# EAGLE design SlippiBoardRev2 (EAGLE 7.5.0)

## Sheet 1 of 3: TM4C129ENCPDT GPIO
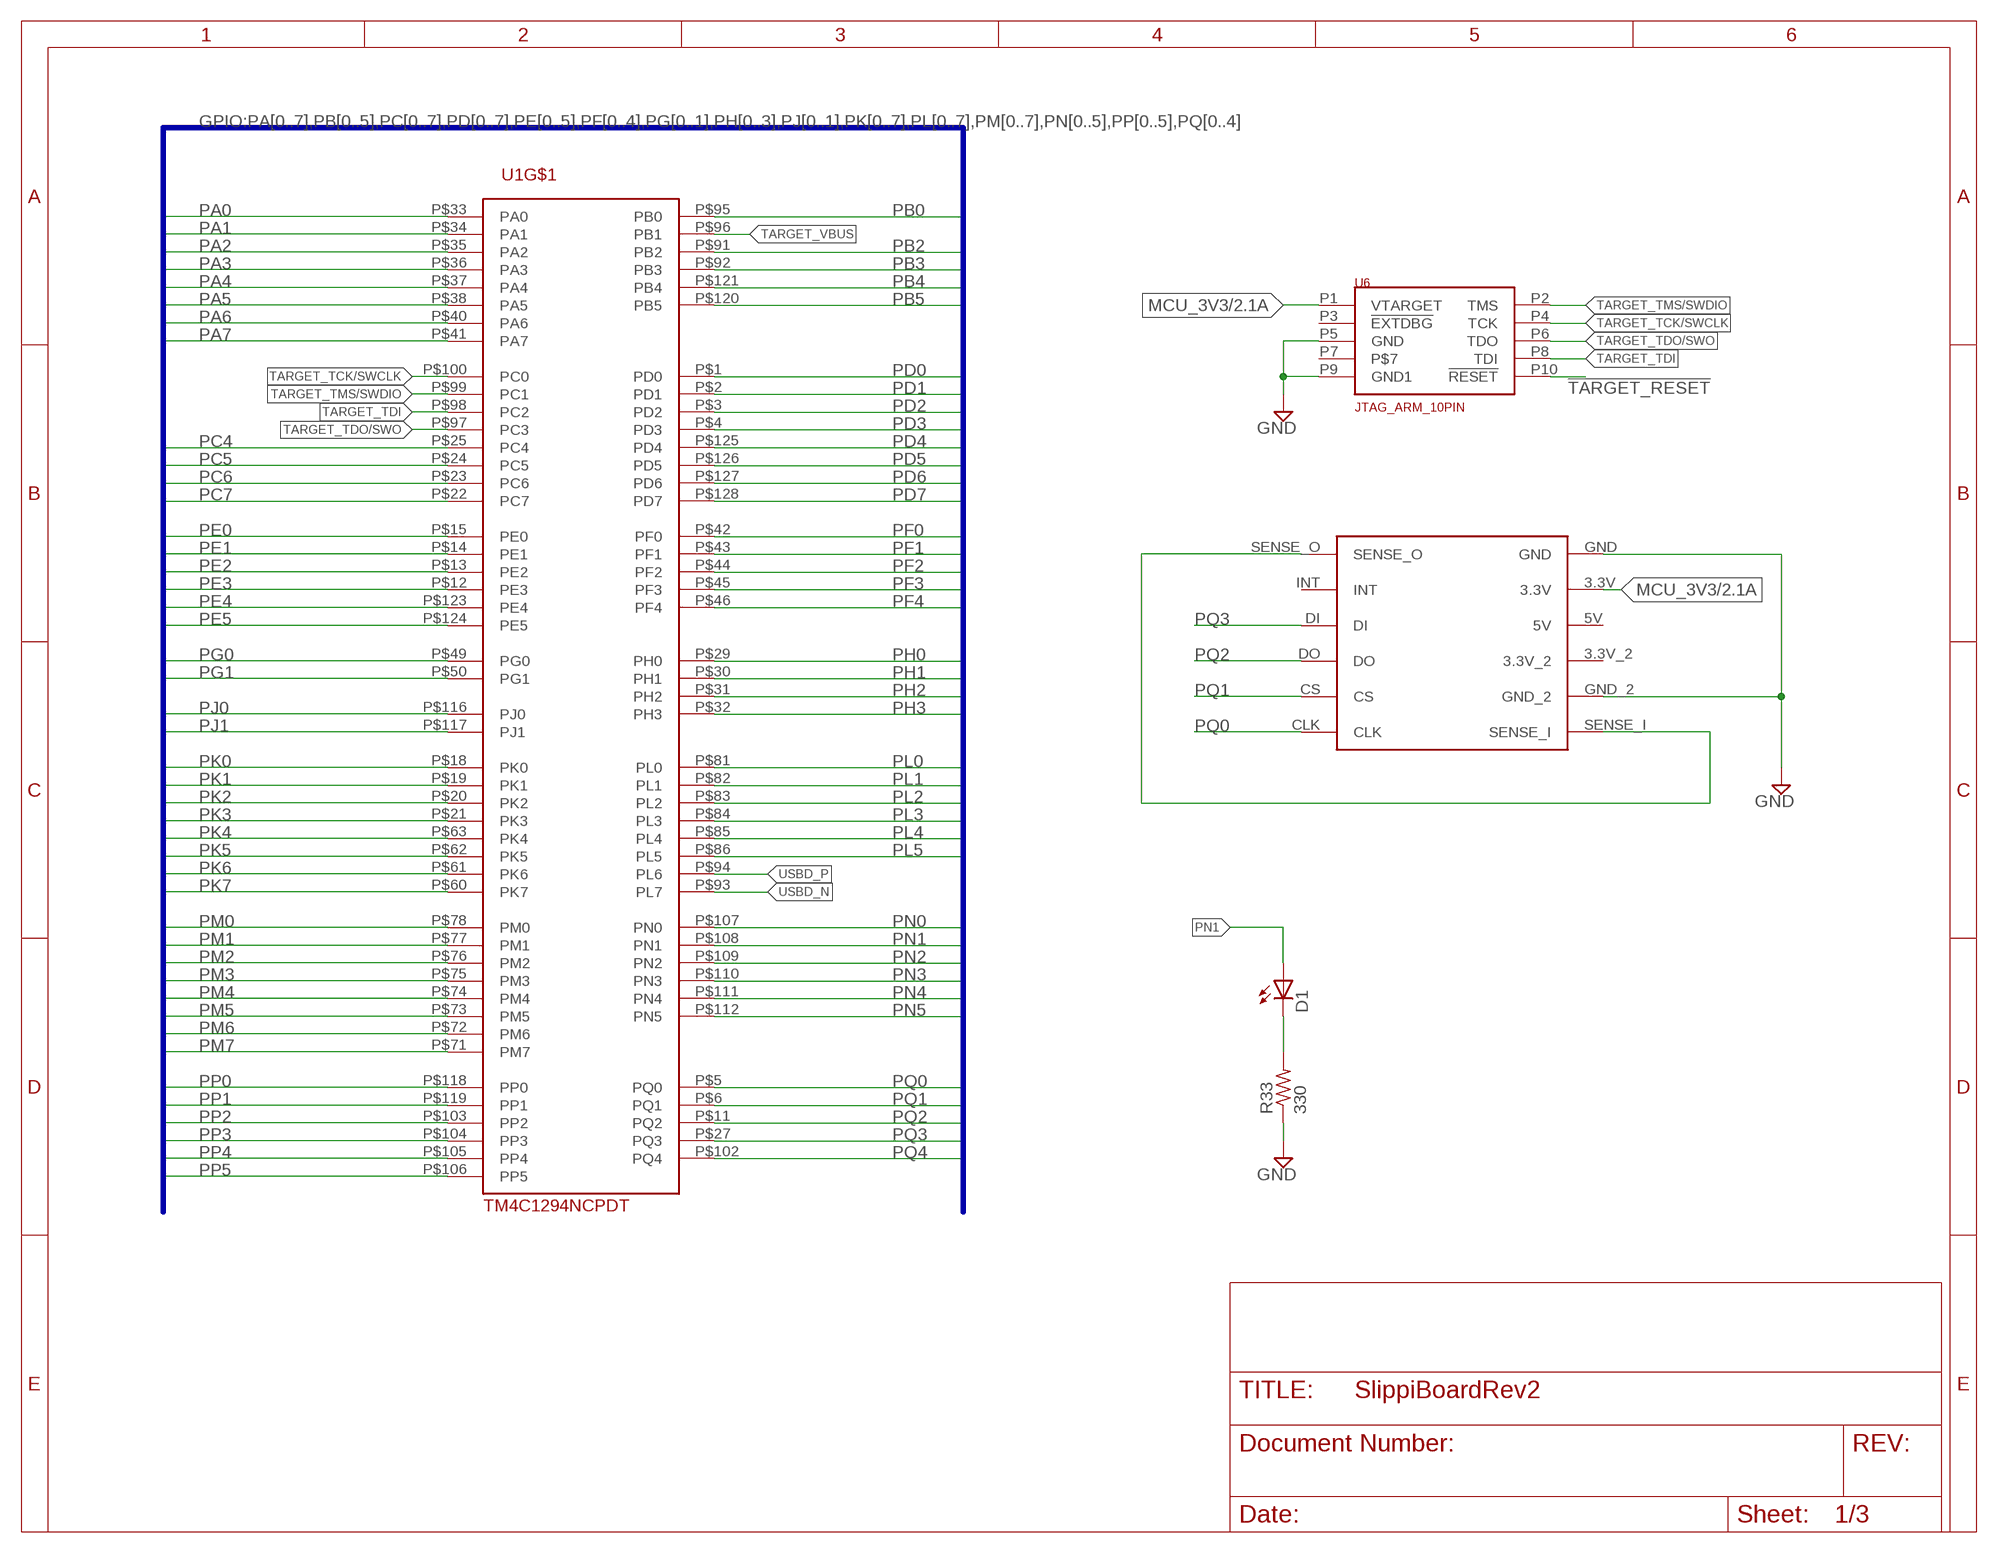
[diagram p0: schematic, sheet 1]

### Parts
D1  LEDCHIPLED_0603  [CHIPLED_0603]
R33  330  R-US_R0402  [R0402]
U1  TM4C1294NCPDT  [TQFP-128]
U6  JTAG_ARM_10PIN  [CON_2X5_50MIL]
U$1  GC_MEMCARD_CON  [GC_MEMCARD_CON]

### Nets
!TARGET_RESET: U6.P10(!RESET) ; also sheet 3
GND: R33.1 U6.P5(GND) U6.P9(GND1) U$1.GND U$1.GND_2 ; also sheet 2,3
MCU_3V3: U6.P1(VTARGET) U$1.3.3V ; also sheet 2,3
N$1: U$1.SENSE_I U$1.SENSE_O
N$6: D1.C R33.2
PA0: U1.P$33(PA0)
PA1: U1.P$34(PA1)
PA2: U1.P$35(PA2)
PA3: U1.P$36(PA3)
PA4: U1.P$37(PA4)
PA5: U1.P$38(PA5)
PA6: U1.P$40(PA6)
PA7: U1.P$41(PA7)
PB0: U1.P$95(PB0)
PB2: U1.P$91(PB2)
PB3: U1.P$92(PB3)
PB4: U1.P$121(PB4)
PB5: U1.P$120(PB5)
PC4: U1.P$25(PC4)
PC5: U1.P$24(PC5)
PC6: U1.P$23(PC6)
PC7: U1.P$22(PC7)
PD0: U1.P$1(PD0)
PD1: U1.P$2(PD1)
PD2: U1.P$3(PD2)
PD3: U1.P$4(PD3)
PD4: U1.P$125(PD4)
PD5: U1.P$126(PD5)
PD6: U1.P$127(PD6)
PD7: U1.P$128(PD7)
PE0: U1.P$15(PE0)
PE1: U1.P$14(PE1)
PE2: U1.P$13(PE2)
PE3: U1.P$12(PE3)
PE4: U1.P$123(PE4)
PE5: U1.P$124(PE5)
PF0: U1.P$42(PF0)
PF1: U1.P$43(PF1)
PF2: U1.P$44(PF2)
PF3: U1.P$45(PF3)
PF4: U1.P$46(PF4)
PG0: U1.P$49(PG0)
PG1: U1.P$50(PG1)
PH0: U1.P$29(PH0)
PH1: U1.P$30(PH1)
PH2: U1.P$31(PH2)
PH3: U1.P$32(PH3)
PJ0: U1.P$116(PJ0)
PJ1: U1.P$117(PJ1)
PK0: U1.P$18(PK0)
PK1: U1.P$19(PK1)
PK2: U1.P$20(PK2)
PK3: U1.P$21(PK3)
PK4: U1.P$63(PK4)
PK5: U1.P$62(PK5)
PK6: U1.P$61(PK6)
PK7: U1.P$60(PK7)
PL0: U1.P$81(PL0)
PL1: U1.P$82(PL1)
PL2: U1.P$83(PL2)
PL3: U1.P$84(PL3)
PL4: U1.P$85(PL4)
PL5: U1.P$86(PL5)
PM0: U1.P$78(PM0)
PM1: U1.P$77(PM1)
PM2: U1.P$76(PM2)
PM3: U1.P$75(PM3)
PM4: U1.P$74(PM4)
PM5: U1.P$73(PM5)
PM6: U1.P$72(PM6)
PM7: U1.P$71(PM7)
PN0: U1.P$107(PN0)
PN1: D1.A U1.P$108(PN1)
PN2: U1.P$109(PN2)
PN3: U1.P$110(PN3)
PN4: U1.P$111(PN4)
PN5: U1.P$112(PN5)
PP0: U1.P$118(PP0)
PP1: U1.P$119(PP1)
PP2: U1.P$103(PP2)
PP3: U1.P$104(PP3)
PP4: U1.P$105(PP4)
PP5: U1.P$106(PP5)
PQ0: U1.P$5(PQ0) U$1.CLK
PQ1: U1.P$6(PQ1) U$1.CS
PQ2: U1.P$11(PQ2) U$1.DO
PQ3: U1.P$27(PQ3) U$1.DI
PQ4: U1.P$102(PQ4)
TARGET_TCK/SWCLK: U1.P$100(PC0) U6.P4(TCK)
TARGET_TDI: U1.P$98(PC2) U6.P8(TDI)
TARGET_TDO/SWO: U1.P$97(PC3) U6.P6(TDO)
TARGET_TMS/SWDIO: U1.P$99(PC1) U6.P2(TMS)
TARGET_VBUS: U1.P$96(PB1)
USBD_N [USB]: U1.P$93(PL7)
USBD_P [USB]: U1.P$94(PL6)
Unconnected: U6.P3(!EXTDBG) U6.P7 U$1.3.3V_2 U$1.5V U$1.INT

### Buses
GPIO:PA[0..7],PB[0..5],PC[0..7],PD[0..7],PE[0..5],PF[0..4],PG[0..1],PH[0..3],PJ[0..1],PK[0..7],PL[0..7],PM[0..7],PN[0..5],PP[0..5],PQ[0..4]

## Sheet 2 of 3: Ethernet
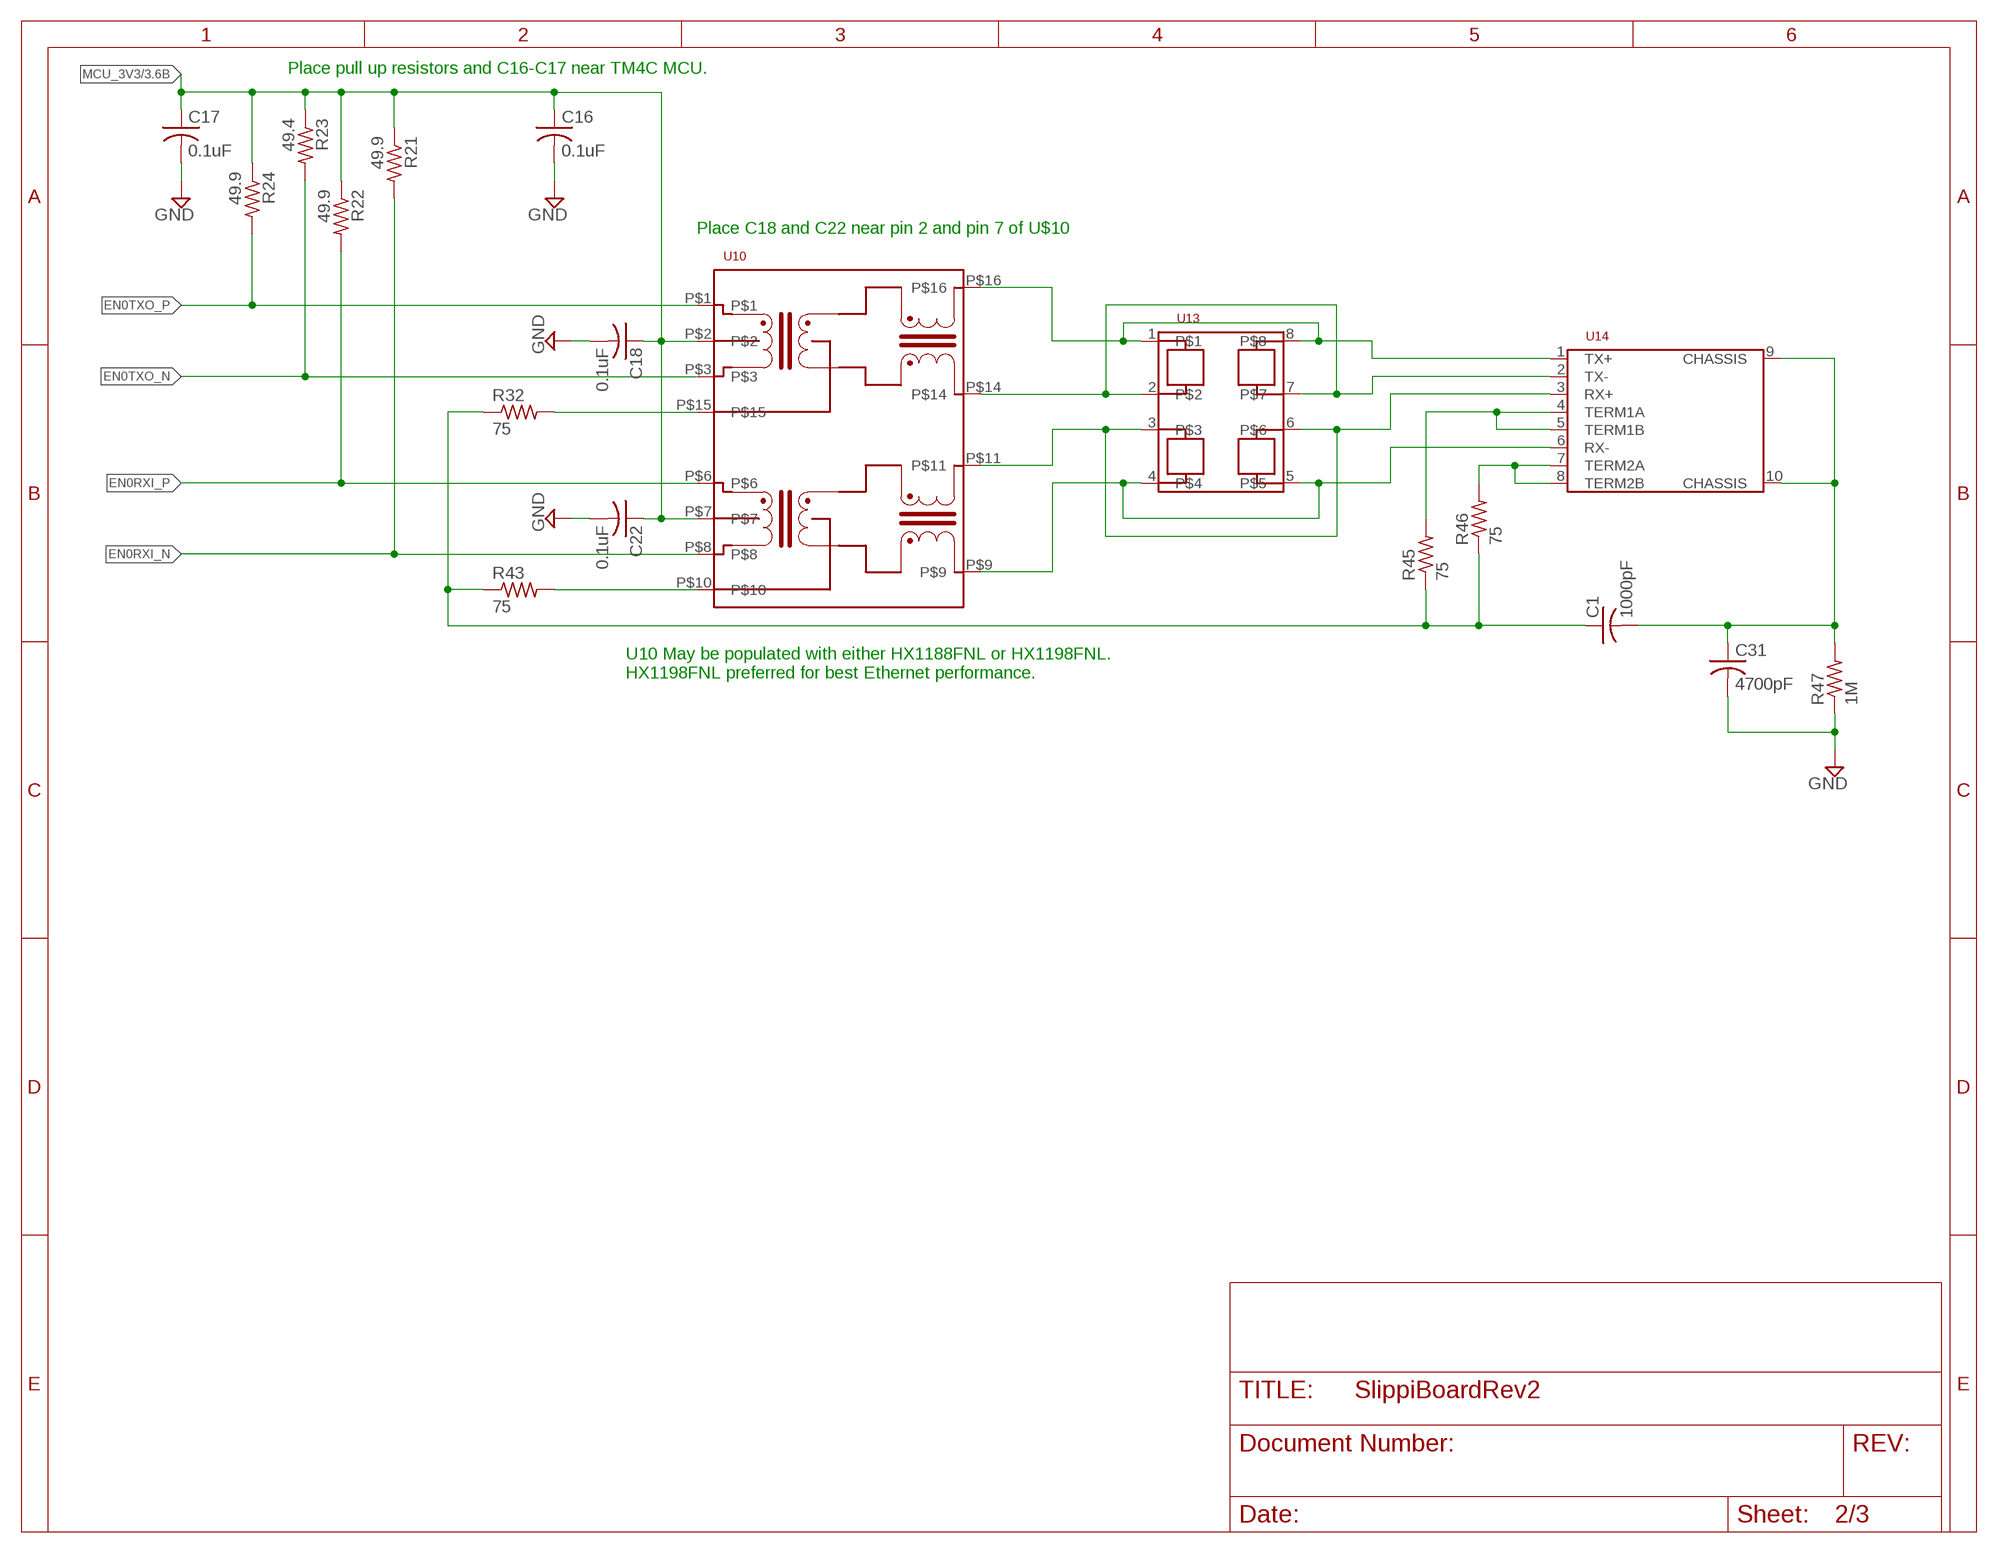
[diagram p1: schematic, sheet 2]

### Parts
C1  1000pF  C-USC1210  [C1210]
C16  0.1uF  C-USC0402  [C0402]
C17  0.1uF  C-USC0402  [C0402]
C18  0.1uF  C-USC0402  [C0402]
C22  0.1uF  C-USC0402  [C0402]
C31  4700pF  C-USC1812  [C1812]
R21  49.9  R-US_R0402  [R0402]
R22  49.9  R-US_R0402  [R0402]
R23  49.4  R-US_R0402  [R0402]
R24  49.9  R-US_R0402  [R0402]
R32  75  R-US_R0402  [R0402]
R43  75  R-US_R0402  [R0402]
R45  75  R-US_R0402  [R0402]
R46  75  R-US_R0402  [R0402]
R47  1M  R-US_R1206  [R1206]
U10  MAG_PULSE_HX1188FNL  [MAG_PULSE_HX1188FNL]
U13  SLVU2.8-4  [D8]
U14  JACK_RJ45_NOMAG_NOLED_TECON  [RJ45_TE_CON_NOMAG_NOLED]

### Nets
CHASSIS: C1.2 C31.1 R47.2 U14.9(CHASSIS) U14.10(CHASSIS)
EN0RXI_N [Ethernet]: R21.2 U10.P$8 ; also sheet 3
EN0RXI_P [Ethernet]: R22.2 U10.P$6 ; also sheet 3
EN0TXO_N [Ethernet]: R23.2 U10.P$3 ; also sheet 3
EN0TXO_P [Ethernet]: R24.2 U10.P$1 ; also sheet 3
GND: C16.2 C17.2 C18.2 C22.2 C31.2 R47.1 ; also sheet 1,3
JACK_RX_N [Ethernet]: U10.P$9 U13.4 U13.5 U14.6(RX-)
JACK_RX_P [Ethernet]: U10.P$11 U13.3 U13.6 U14.3(RX+)
JACK_TX_N [Ethernet]: U10.P$14 U13.2 U13.7 U14.2(TX-)
JACK_TX_P [Ethernet]: U10.P$16 U13.1 U13.8 U14.1(TX+)
MCU_3V3: C16.1 C17.1 C18.1 C22.1 R21.1 R22.1 R23.1 R24.1 U10.P$2 U10.P$7 ; also sheet 1,3
N$32: R32.2 U10.P$15
N$34: R43.2 U10.P$10
N$36: C1.1 R32.1 R43.1 R45.1 R46.1
N$44: R45.2 U14.4(TERM1A) U14.5(TERM1B)
N$45: R46.2 U14.7(TERM2A) U14.8(TERM2B)

### Notes on the sheet
- Place pull up resistors and C16-C17 near TM4C MCU.
- Place C18 and C22 near pin 2 and pin 7 of U$10
- U10 May be populated with either HX1188FNL or HX1198FNL. 
  HX1198FNL preferred for best Ethernet performance.

## Sheet 3 of 3: Power
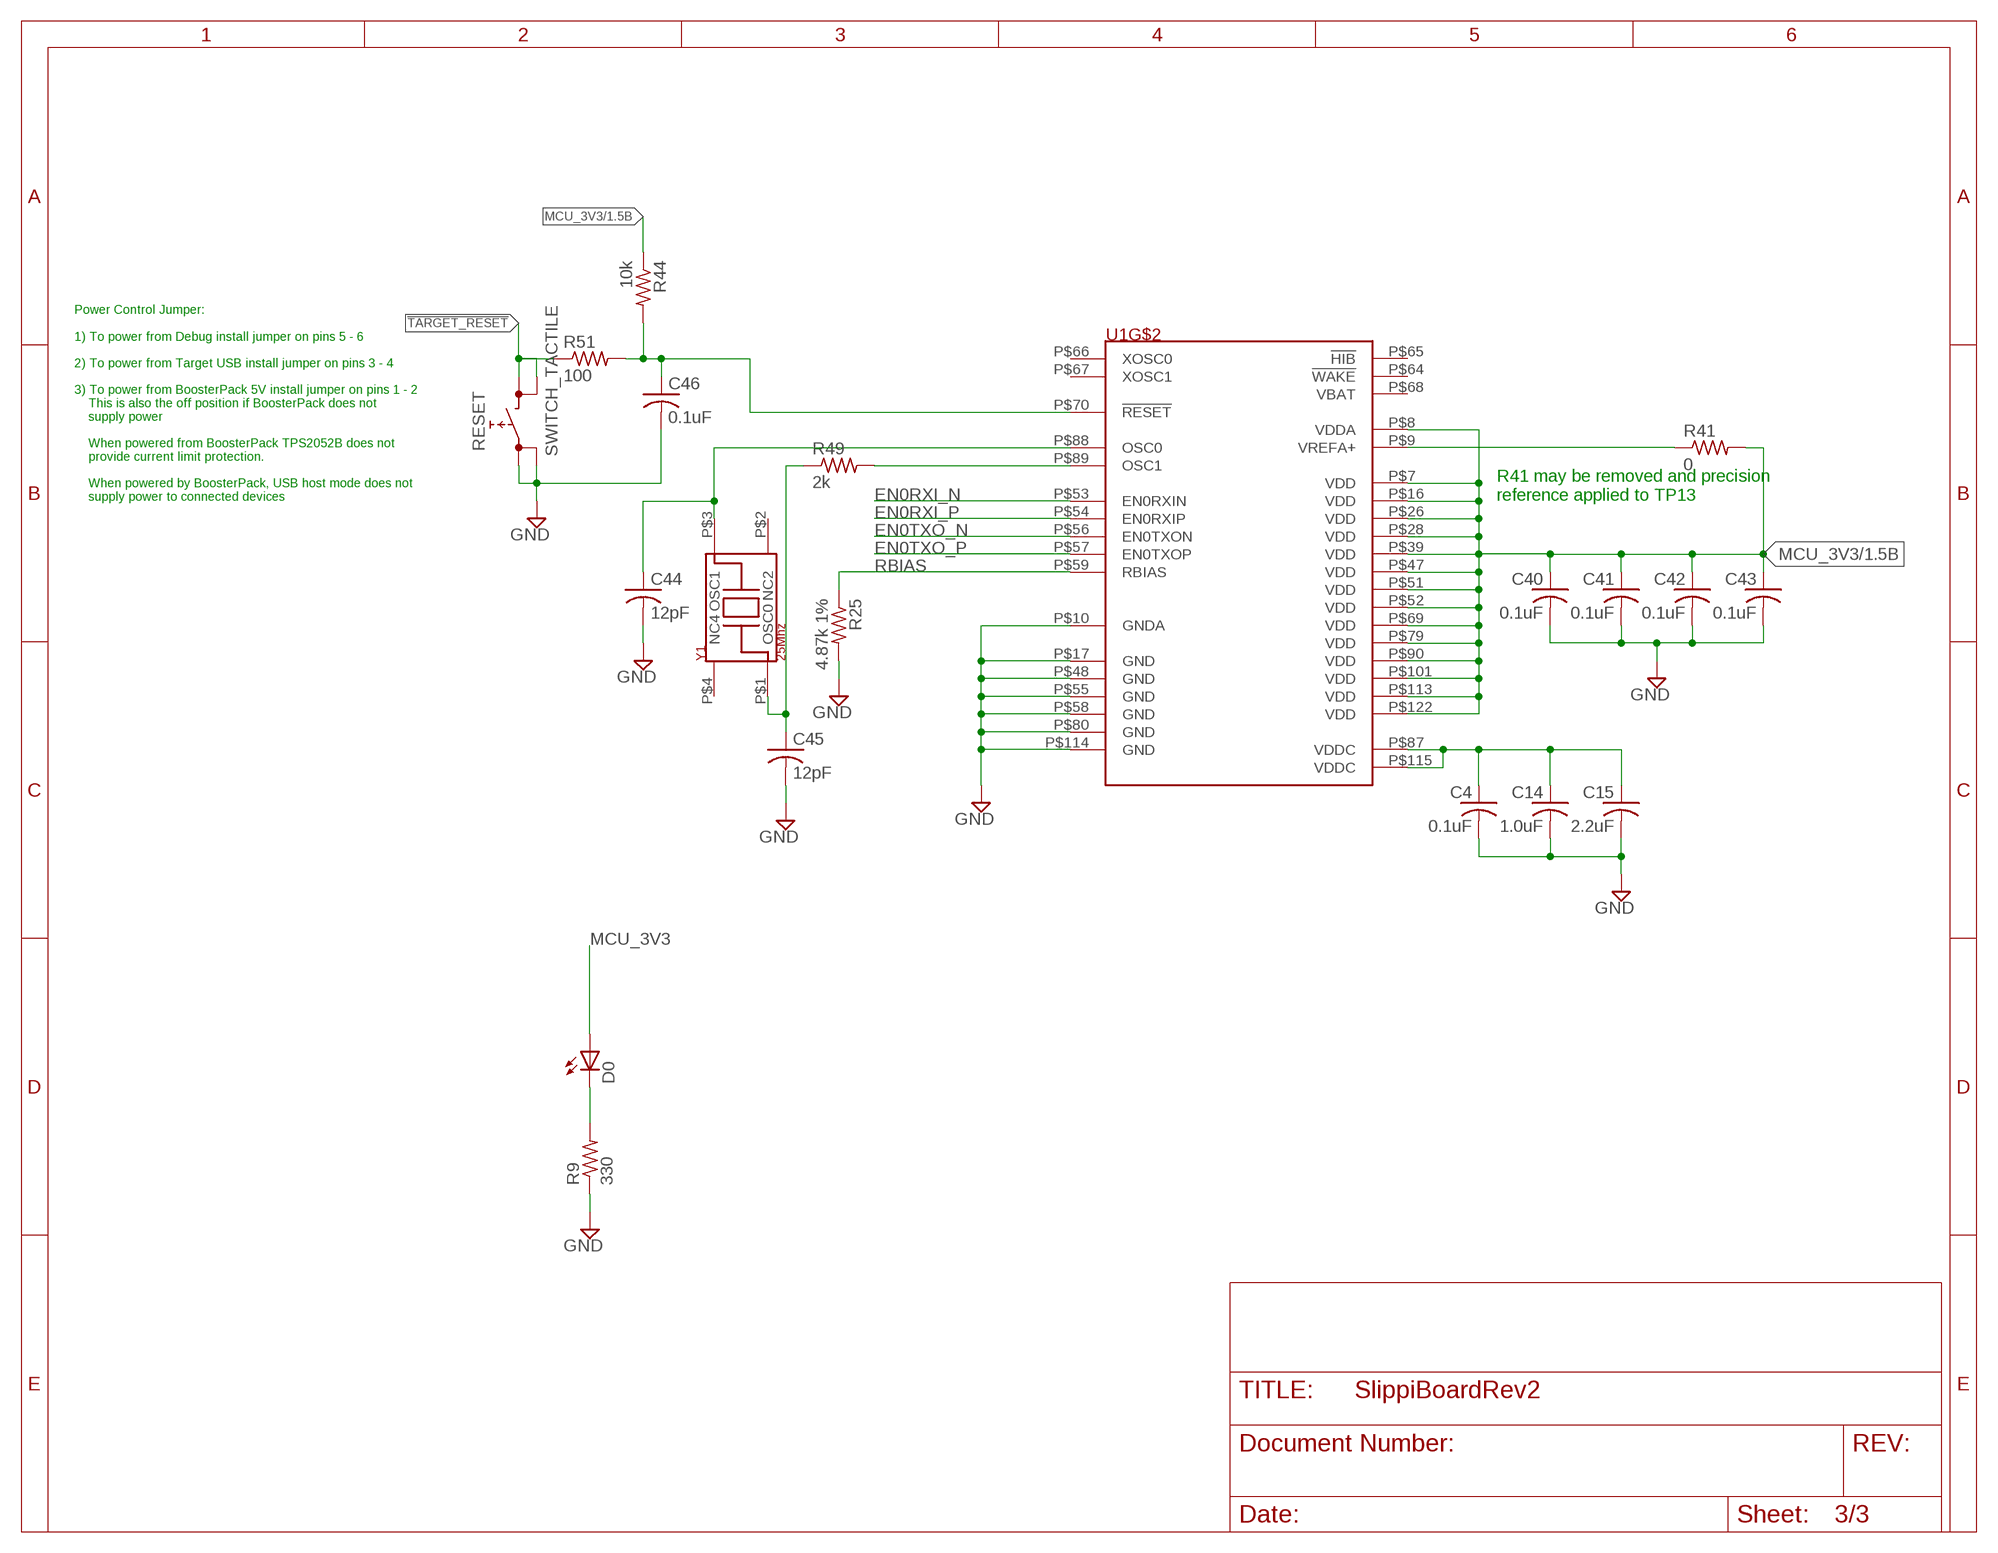
[diagram p2: schematic, sheet 3]

### Parts
C4  0.1uF  C-USC0402  [C0402]
C14  1.0uF  C-USC0402  [C0402]
C15  2.2uF  C-USC0603K  [C0603K]
C40  0.1uF  C-USC0402  [C0402]
C41  0.1uF  C-USC0402  [C0402]
C42  0.1uF  C-USC0402  [C0402]
C43  0.1uF  C-USC0402  [C0402]
C44  12pF  C-USC0402  [C0402]
C45  12pF  C-USC0402  [C0402]
C46  0.1uF  C-USC0402  [C0402]
D0  LEDCHIPLED_0603  [CHIPLED_0603]
R9  330  R-US_R0402  [R0402]
R25  4.87k 1%  R-US_R0402  [R0402]
R41  0  R-US_R0402  [R0402]
R44  10k  R-US_R0402  [R0402]
R49  2k  R-US_R0402  [R0402]
R51  100  R-US_R0402  [R0402]
RESET  SWITCH_TACTILE  [SWITCH_6MM_6MM_TE_CON_SMD]
Y1  25Mhz  NX3225GA  [NDK3.2X2.5]

### Nets
!TARGET_RESET: R51.1 RESET.P$3 RESET.P$4 ; also sheet 1
!TARGET_RESET_FILTERED: C46.1 R44.2 R51.2 U1.P$70(!RESET)
EN0RXI_N [Ethernet]: U1.P$53(EN0RXIN) ; also sheet 2
EN0RXI_P [Ethernet]: U1.P$54(EN0RXIP) ; also sheet 2
EN0TXO_N [Ethernet]: U1.P$56(EN0TXON) ; also sheet 2
EN0TXO_P [Ethernet]: U1.P$57(EN0TXOP) ; also sheet 2
GND: C4.2 C14.2 C15.2 C40.2 C41.2 C42.2 C43.2 C44.2 C45.2 C46.2 R9.1 R25.2 RESET.P$1 RESET.P$2 U1.P$10(GNDA) U1.P$17(GND) U1.P$48(GND) U1.P$55(GND) U1.P$58(GND) U1.P$80(GND) U1.P$114(GND) ; also sheet 1,2
MCU_3V3: C40.1 C41.1 C42.1 C43.1 D0.A R41.2 R44.1 U1.P$7(VDD) U1.P$8(VDDA) U1.P$16(VDD) U1.P$26(VDD) U1.P$28(VDD) U1.P$39(VDD) U1.P$47(VDD) U1.P$51(VDD) U1.P$52(VDD) U1.P$69(VDD) U1.P$79(VDD) U1.P$90(VDD) U1.P$101(VDD) U1.P$113(VDD) U1.P$122(VDD) ; also sheet 1,2
N$3: D0.C R9.2
N$16: R49.2 U1.P$89(OSC1)
N$29: C45.1 R49.1 Y1.P$1(OSC0)
N$31: C44.1 U1.P$88(OSC0) Y1.P$3(OSC1)
RBIAS: R25.1 U1.P$59(RBIAS)
TARGET_VDDC: C4.1 C14.1 C15.1 U1.P$87(VDDC) U1.P$115(VDDC)
VREF+: R41.1 U1.P$9(VREFA+)
Unconnected: U1.P$64(!WAKE) U1.P$65(!HIB) U1.P$66(XOSC0) U1.P$67(XOSC1) U1.P$68(VBAT) Y1.P$2(NC2) Y1.P$4(NC4)

### Notes on the sheet
- Power Control Jumper:
  
  1) To power from Debug install jumper on pins 5 - 6
  
  2) To power from Target USB install jumper on pins 3 - 4
  
  3) To power from BoosterPack 5V install jumper on pins 1 - 2
      This is also the off position if BoosterPack does not 
      supply power
  
      When powered from BoosterPack TPS2052B does not 
      provide current limit protection.
     
      When powered by BoosterPack, USB host mode does not 
      supply power to connected devices
- R41 may be removed and precision
  reference applied to TP13

## Library data of the parts
C1 = EK-TM4C1294XL REV A:C-US: CAPACITOR, American symbol; GNUM: G10-C1210-C102-ZCA
C4 C16-C18 C22 C40-C43 C46 = ek-tm4c129exl:C-US: CAPACITOR, American symbol; GNUM: G10-C0402-C104-HBA
C14 = ek-tm4c129exl:C-US: CAPACITOR, American symbol; GNUM: G10-C0402-C105-GBB
C15 = ek-tm4c129exl:C-US: CAPACITOR, American symbol; DIGIKEY_PARTNUM: 311-1451-2-ND; GNUM: G10-C0603-C225-HBB
C31 = ek-tm4c129exl:C-US: CAPACITOR, American symbol; GNUM: G10-C1812-C472-ZBA
C44 C45 = ek-tm4c129exl:C-US: CAPACITOR, American symbol; GNUM: G10-C0402-C120-AAC
D0 D1 = ek-tm4c129exl:LED: LED OSRAM: - CHIPLED LG R971, LG N971, LY N971, LG Q971, LY Q971, LO R971, LY R971 LH N974, LH R974 LS Q976, LO Q976, LY Q976 LO Q996 - Hyper CHIPLED LW Q18S LB Q993, LB Q99A, LB R99A - SideLED LS A670, LO A670, LY A670, LG A670, LP A670 LB A673, LV A673, LT A673, LW A673 LH A674 LY A675 LS A676, LA A676, LO A676, LY A676, LW A676 LS A679, LY A679, LG A679 - Hyper Micro SIDELED® LS Y876, LA Y876, LO Y876, LY Y876 LT Y87S - SmartLED LW L88C, LW L88S LB L89C, LB L89S, LG L890 LS L89K, LO L89K, LY L89K LS L896, LA L896, LO L896, LY L896 - TOPLED LS T670, LO T670, LY T670, LG T670, LP T670 LSG T670, LSP T670, LSY T670, LOP T670, LYG T670 LG T671, LOG T671, LSG T671 LB T673, LV T673, LT T673, LW T673 LH T674 LS T676, LA T676, LO T676, LY T676, LB T676, LH T676, LSB T676, LW T676 LB T67C, LV T67C, LT T67C, LS T67K, LO T67K, LY T67K, LW E67C LS E67B, LA E67B, LO E67B, LY E67B, LB E67C, LV E67C, LT E67C LW T67C LS T679, LY T679, LG T679 LS T770, LO T770, LY T770, LG T770, LP T770 LB T773, LV T773, LT T773, LW T773 LH T774 LS E675, LA E675, LY E675, LS T675 LS T776, LA T776, LO T776, LY T776, LB T776 LHGB T686 LT T68C, LB T68C - Hyper Mini TOPLED® LB M676 - Mini TOPLED Santana® LG M470 LS M47K, LO M47K, LY M47K Source: http://www.osram.convergy.de LUXEON: - LUMILED® LXK2-PW12-R00, LXK2-PW12-S00, LXK2-PW14-U00, LXK2-PW14-V00 LXK2-PM12-R00, LXK2-PM12-S00, LXK2-PM14-U00 LXK2-PE12-Q00, LXK2-PE12-R00, LXK2-PE12-S00, LXK2-PE14-T00, LXK2-PE14-U00 LXK2-PB12-K00, LXK2-PB12-L00, LXK2-PB12-M00, LXK2-PB14-N00, LXK2-PB14-P00, LXK2-PB14-Q00 LXK2-PR12-L00, LXK2-PR12-M00, LXK2-PR14-Q00, LXK2-PR14-R00 LXK2-PD12-Q00, LXK2-PD12-R00, LXK2-PD12-S00 LXK2-PH12-R00, LXK2-PH12-S00 LXK2-PL12-P00, LXK2-PL12-Q00, LXK2-PL12-R00 Source: www.luxeon.com KINGBRIGHT: KA-3528ASYC Source: www.kingbright.com; GNUM: G14-D0603-GR00-AAA
R9 R33 = ek-tm4c129exl:R-US_: RESISTOR, American symbol; GNUM: G11-R0402-3300-AAA
R21-R24 = ek-tm4c129exl:R-US_: RESISTOR, American symbol; GNUM: G11-R0402-49R9-ABA
R25 = ek-tm4c129exl:R-US_: RESISTOR, American symbol; GNUM: G11-R0402-4871-ABA
R32 R43 R45 R46 = ek-tm4c129exl:R-US_: RESISTOR, American symbol; GNUM: G11-R0402-75R0-AAA
R41 = ek-tm4c129exl:R-US_: RESISTOR, American symbol; GNUM: G11-R0402-0000-AAA
R44 = ek-tm4c129exl:R-US_: RESISTOR, American symbol; GNUM: G11-R0402-1002-AAA
R47 = EK-TM4C1294XL REV A:R-US_: RESISTOR, American symbol; GNUM: G11-R1206-R105-CAA
R49 = ek-tm4c129exl:R-US_: RESISTOR, American symbol; GNUM: G11-R0402-R202-AAA
R51 = ek-tm4c129exl:R-US_: RESISTOR, American symbol; GNUM: G11-R0402-1000-AAA
RESET = ek-tm4c129exl:SWITCH_TACTILE; GNUM: G21-4P6MM-B3S1-AAA
U1 = EK-TM4C1294XL REV A:TM4C1294NCPDT; GNUM: G50-QF128-C1294-ALH
U6 = ek-tm4c129exl:JTAG_ARM_10PIN; GNUM: G22-SMVES-2X5A-BBC
U10 = ek-tm4c129exl:MAG_PULSE_HX1188FNL; GNUM: G12-SOI16-1TO1-ZZQ
U13 = ek-tm4c129exl:SLVU2.8-4; GNUM: G14-SOIC8-SLVU-DAA
U14 = ek-tm4c129exl:JACK_RJ45_NOMAG_NOLED_TECON; GNUM: G20-8RJ45-ENET-AAA
U$1 = jascustom:GC_MEMCARD_CON
Y1 = ek-tm4c129exl:NX3225GA; GNUM: G15-32X25-2506-AAA

## Net classes
1 USB: width 0.275 mm, clearance 0.152 mm
2 Ethernet: width 0.22 mm, clearance 0.152 mm

## Board
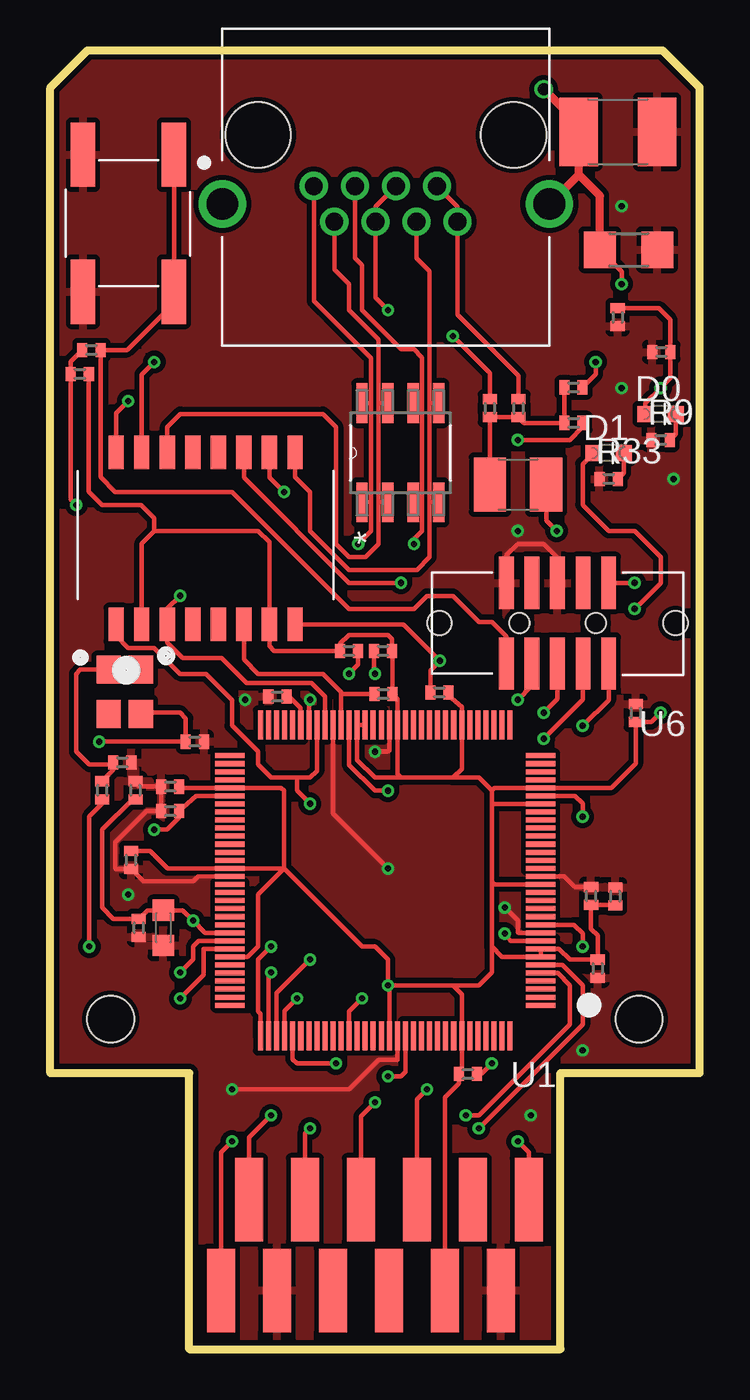
[diagram p3: board, top side]
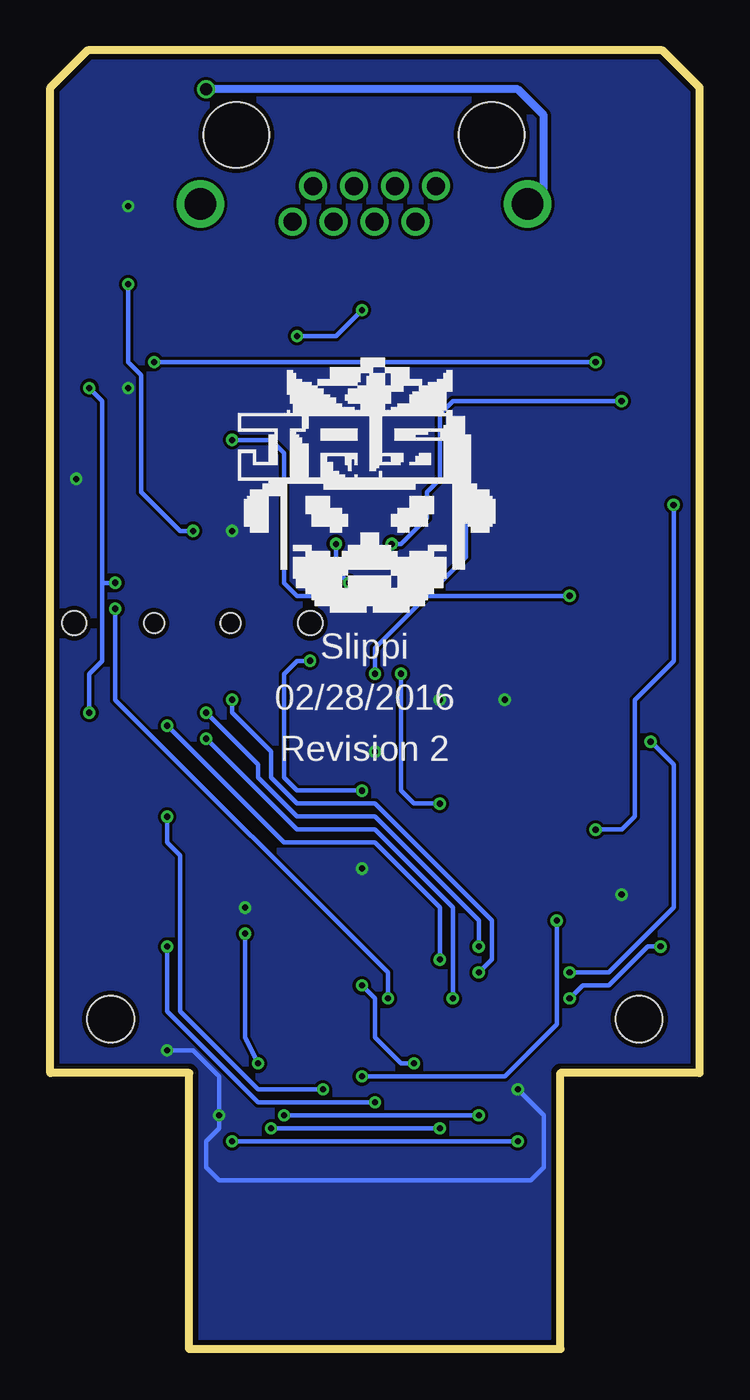
[diagram p4: board, bottom side, seen from below]

Size 32.27 x 64.54 mm. Coordinates in mm from the lower left corner, seen from the top.
Outline: 6.91,0 6.91,13.72 0,13.72 0,62.69 1.85,64.54 30.42,64.54 32.27,62.69 32.27,13.72 25.36,13.72 25.36,0 6.91,0
Copper layers (1*16): Top 0.035mm / dielectric 1.5mm / Bottom 0.035mm
Design rules "SeeedStudio_2layer_DRU_no_angle_20140221": minimum track width 6mil, minimum drill 12mil, track to track 6mil, track to pad 6mil, pad to pad 6mil, via to via 6mil, smd to smd 0mil, copper to edge 10mil, drill to drill 10mil, minimum pad ring 10mil, minimum via ring 6mil, stop-mask expansion 2mil, vias tented up to drill 100mil, thermal gap 10mil
Holes 2.32 mm at 3,16.4 29.27,16.4

### Footprints (pad centres in the part's own frame; a part is rotated, then mirrored left to right if it is on the bottom)
C1210 = smd 1.6 x 2.7: 1 -1.4,0; 2 1.4,0
C0402 = smd 0.5 x 0.7: 1 -0.45,0; 2 0.45,0
C0603K = smd 1.05 x 1.08: 1 -0.875,0; 2 0.875,0
C1812 = smd 1.9 x 3.4: 1 -1.95,0; 2 1.95,0
CHIPLED_0603 = smd 0.8 x 0.8: A 0,-0.75; C 0,0.75
R0402 = smd 0.5 x 0.7: 1 -0.45,0; 2 0.45,0
R1206 = smd 1.6 x 1.803: 1 -1.422,0; 2 1.422,0
SWITCH_6MM_6MM_TE_CON_SMD = smd 1.2 x 3.2: P$1 4.521,6.807; P$2 4.521,0; P$3 0,6.807; P$4 0,0
TQFP-128 = smd 1.45 x 0.25: P$1 0,0; P$2 0,-0.4; P$3 0,-0.8; P$4 0,-1.2; P$5 0,-1.6; P$6 0,-2; P$7 0,-2.4; P$8 0,-2.8; P$9 0,-3.2; P$10 0,-3.6; P$11 0,-4; P$12 0,-4.4; P$13 0,-4.8; P$14 0,-5.2; P$15 0,-5.6; P$16 0,-6; P$17 0,-6.4; P$18 0,-6.8; P$19 0,-7.2; P$20 0,-7.6; P$21 0,-8; P$22 0,-8.4; P$23 0,-8.8; P$24 0,-9.2; P$25 0,-9.6; P$26 0,-10; P$27 0,-10.4; P$28 0,-10.8; P$29 0,-11.2; P$30 0,-11.6; P$31 0,-12; P$32 0,-12.4; P$65 15.45,-12.4; P$66 15.45,-12; P$67 15.45,-11.6; P$68 15.45,-11.2; P$69 15.45,-10.8; P$70 15.45,-10.4; P$71 15.45,-10; P$72 15.45,-9.6; P$73 15.45,-9.2; P$74 15.45,-8.8; P$75 15.45,-8.4; P$76 15.45,-8; P$77 15.45,-7.6; P$78 15.45,-7.2; P$79 15.45,-6.8; P$80 15.45,-6.4; P$81 15.45,-6; P$82 15.45,-5.6; P$83 15.45,-5.2; P$84 15.45,-4.8; P$85 15.45,-4.4; P$86 15.45,-4; P$87 15.45,-3.6; P$88 15.45,-3.2; P$89 15.45,-2.8; P$90 15.45,-2.4; P$91 15.45,-2; P$92 15.45,-1.6; P$93 15.45,-1.2; P$94 15.45,-0.8; P$95 15.45,-0.4; P$96 15.45,0 | smd 0.25 x 1.45: P$33 1.525,-13.925; P$34 1.925,-13.925; P$35 2.325,-13.925; P$36 2.725,-13.925; P$37 3.125,-13.925; P$38 3.525,-13.925; P$39 3.925,-13.925; P$40 4.325,-13.925; P$41 4.725,-13.925; P$42 5.125,-13.925; P$43 5.525,-13.925; P$44 5.925,-13.925; P$45 6.325,-13.925; P$46 6.725,-13.925; P$47 7.125,-13.925; P$48 7.525,-13.925; P$49 7.925,-13.925; P$50 8.325,-13.925; P$51 8.725,-13.925; P$52 9.125,-13.925; P$53 9.525,-13.925; P$54 9.925,-13.925; P$55 10.325,-13.925; P$56 10.725,-13.925; P$57 11.125,-13.925; P$58 11.525,-13.925; P$59 11.925,-13.925; P$60 12.325,-13.925; P$61 12.725,-13.925; P$62 13.125,-13.925; P$63 13.525,-13.925; P$64 13.925,-13.925; P$97 13.925,1.525; P$98 13.525,1.525; P$99 13.125,1.525; P$100 12.725,1.525; P$101 12.325,1.525; P$102 11.925,1.525; P$103 11.525,1.525; P$104 11.125,1.525; P$105 10.725,1.525; P$106 10.325,1.525; P$107 9.925,1.525; P$108 9.525,1.525; P$109 9.125,1.525; P$110 8.725,1.525; P$111 8.325,1.525; P$112 7.925,1.525; P$113 7.525,1.525; P$114 7.125,1.525; P$115 6.725,1.525; P$116 6.325,1.525; P$117 5.925,1.525; P$118 5.525,1.525; P$119 5.125,1.525; P$120 4.725,1.525; P$121 4.325,1.525; P$122 3.925,1.525; P$123 3.525,1.525; P$124 3.125,1.525; P$125 2.725,1.525; P$126 2.325,1.525; P$127 1.925,1.525; P$128 1.525,1.525
CON_2X5_50MIL = smd 0.74 x 2.6: P1 0,0; P2 0,4.008; P3 1.27,0; P4 1.27,4.008; P5 2.54,0; P6 2.54,4.008; P7 3.81,0; P8 3.81,4.008; P9 5.08,0; P10 5.08,4.008 | hole 1: 4.44,2; 0.64,2 | hole 1.2: 8.407,2; -3.327,2
MAG_PULSE_HX1188FNL = smd 0.76 x 1.67: P$1 0,0; P$2 1.27,0; P$3 2.54,0; P$4 3.81,0; P$5 5.08,0; P$6 6.35,0; P$7 7.62,0; P$8 8.89,0; P$9 8.89,8.55; P$10 7.62,8.55; P$11 6.35,8.55; P$12 5.08,8.55; P$13 3.81,8.55; P$14 2.54,8.55; P$15 1.27,8.55; P$16 0,8.55
D8 = smd 1.981 x 0.559: 1 -2.464,1.905; 2 -2.464,0.635; 3 -2.464,-0.635; 4 -2.464,-1.905; 5 2.464,-1.905; 6 2.464,-0.635; 7 2.464,0.635; 8 2.464,1.905
RJ45_TE_CON_NOMAG_NOLED = drill 0.89: 1 9.93,2.54; 2 8.91,4.32; 3 7.89,2.54; 4 6.87,4.32; 5 5.85,2.54; 6 4.83,4.32; 7 3.81,2.54; 8 2.79,4.32 | drill 1.57: 9 -1.78,3.43; 10 14.48,3.43 | hole 3.25: 0,0; 12.7,0
GC_MEMCARD_CON = smd 1.39 x 4.15: 3.3V 3.475,-2.085; 3.3V_2 -2.085,-2.085; 5V 0.695,-2.085; CLK -6.255,2.433; CS -3.475,2.433; DI 2.085,2.433; DO -0.695,2.433; GND 6.255,-2.085; GND_2 -4.865,-2.085; INT 4.865,2.433; SENSE_I -7.645,-2.085; SENSE_O 7.645,2.433
NDK3.2X2.5 = smd 1.4 x 1.2: P$1 0,0; P$2 2.2,0; P$3 2.2,1.6; P$4 0,1.6

### Placement (x,y rotation side)
C1  23.25,42.96 0 top
C4  4.23,27.77 90 top
C14  4.4,20.94 270 top
C15  5.62,20.94 270 top
C16  28.08,22.5 90 top
C17  30.37,49.55 180 top
C18  29.1,31.61 90 top
C22  28.2,51.28 270 top
C31  28.21,60.49 0 top
C40  5.96,27.95 180 top
C41  26.88,22.52 90 top
C42  27.2,18.91 270 top
C43  4.02,24.31 270 top
C44  7.19,30.19 0 top
C45  3.58,29.16 0 top
C46  5.96,26.74 180 top
D0  30.33,46.47 270 top
D1  27.75,44.53 270 top
R9  30.33,45.18 0 top
R21  19.34,32.64 180 top
R22  16.55,32.55 180 top
R23  16.54,34.7 180 top
R24  14.85,34.7 0 top
R25  11.29,32.43 180 top
R32  26.01,47.79 0 top
R33  27.75,43.24 0 top
R41  20.75,13.68 180 top
R43  26.01,46.03 0 top
R44  1.47,48.46 180 top
R45  21.85,46.75 90 top
R46  23.27,46.75 90 top
R47  28.74,54.63 180 top
R49  2.58,27.77 270 top
R51  2.04,49.64 180 top
RESET  6.15,59.35 180 top
U1  24.38,17.09 180 top
U6  27.75,38.08 180 top
U10  3.27,36.01 0 top
U13  17.4,44.54 90 top
U14  23.03,60.34 180 top
U$1  16.14,5 0 top
Y1  2.9,33.77 270 top

### Tracks (layer width: path | path; a pad name or v marks a point on that pad's centre or on a via)
!TARGET_RESET
  Top 0.228: U6.P10 22.67,35.41 21.94,36.14 21.3,36.14 20.01,37.43 18.72,37.43 18.07,36.79 14.84,36.79 9.04,42.6 3.23,42.6 2.49,43.33 R51.1
  Top 0.229: R51.1 3.82,49.64 6.15,51.97 RESET.P$3 6.15,58.42 6.45,58.73 6.45,59.04 RESET.P$4
!TARGET_RESET_FILTERED  (via drill 0.3)
  Top 0.229: U1.P$70 7.24,27.49 C46.1 6.41,26.42 5.81,25.82 v5.16,25.82 | R51.2 1.02,49.07 R44.2 1.02,42.22 v1.29,41.95
  Bottom 0.229: v1.29,41.95 1.29,34.21 3.23,32.27 3.23,26.46 3.87,25.82 v5.16,25.82
CHASSIS  (via drill 0.3, 0.6)
  Top 0.229: C1.2 24.65,41.18 v25.17,40.66 | v28.4,52.92 28.4,53.55 R47.2
  Top 0.406: v24.52,62.6 26.26,60.87 C31.1 26.26,58.37 | U14.9 26.26,58.37 | R47.2 27.32,57.31 26.26,58.37
  Bottom 0.229: v25.17,40.66 25.82,40.66 27.75,42.6 27.75,48.41 28.4,49.05 v28.4,52.92
  Bottom 0.406: U14.10 7.75,57.71 7.75,61.31 9.04,62.6 v24.52,62.6
EN0RXI_N  (via drill 0.3)
  Top 0.22: v19.36,34.21 17.56,36.01
  Top 0.229: R21.2 18.89,33.73 v19.36,34.21 | v16.78,27.75 16.14,27.75 14.85,29.04 U1.P$53 | U10.P$8 17.56,36.01
  Bottom 0.229: v19.36,34.21 20.01,34.21 20.65,33.56 20.65,28.4 20.01,27.75 v16.78,27.75
EN0RXI_P
  Top 0.229: U10.P$6 9.62,34.27 10.33,33.56 13.55,33.56 14.45,32.66 | U1.P$54 14.45,32.66 | R22.2 14.57,32.55 14.45,32.66
EN0TXO_N  (via drill 0.3)
  Top 0.229: U1.P$56 13.65,32.44 12.98,33.1 9.76,33.1 8.52,34.34 6.59,34.34 5.81,35.11 U10.P$3 5.81,36.79 v6.45,37.43 | R23.2 16.09,33.61 v16.14,33.56
  Bottom 0.229: v16.14,33.56 16.14,34.85 13.55,37.43 v6.45,37.43
EN0TXO_P  (via drill 0.3)
  Top 0.229: U10.P$1 3.27,35.45 3.87,34.85 5.16,34.85 6.45,33.56 7.75,33.56 9.04,32.27 9.04,30.98 10.33,29.69 10.33,29.04 10.97,28.4 12.26,28.4 | 12.26,28.4 12.91,28.4 13.25,28.74 U1.P$57 | R24.2 15.3,34.02 v14.84,33.56 | v12.91,27.11 12.26,27.75 12.26,28.4
  Bottom 0.229: v14.84,33.56 14.84,27.75 14.2,27.11 v12.91,27.11
GND  (via drill 0.3)
  Top 0.228: U6.P9 22.67,39.45 23.23,40.02 24.52,40.02 25.21,39.33 U6.P5 | 17.25,14.37 16.31,14.37 14.84,12.91 v9.04,12.91
  Top 0.229: C41.2 26.08,22.97 25.56,23.49 U1.P$17 | U1.P$80 7.36,23.49 7.1,23.23 4.64,23.23 C43.2 3.25,23.86 3.23,23.88 3.23,25.17 4.8,26.74 C46.2 5.51,26.66 C40.2 4.39,27.95 C4.2 | U1.P$58 12.85,32.21 v12.91,32.27 | U1.P$114 17.25,14.37 | v22.59,21.94 23.23,21.3 23.23,20.73 23.27,20.69 U1.P$10 | U1.P$55 14.05,26.61 v16.78,23.88 | U1.P$48 16.85,29.76 16.78,29.69 v16.14,29.69
  Bottom 0.229: v26.46,14.84 25.17,14.84 23.88,13.55 v23.88,11.62 23.88,10.97 24.52,10.33 24.52,9.04 23.88,8.39 8.39,8.39 7.75,9.04 7.75,11.62 v9.04,12.91
  other vias: 30.98,43.24 28.4,47.76 3.87,22.59 9.68,32.27 28.4,56.8 23.23,40.66
  pour Top (isolate 0.254): 0,0 0,72.93 32.92,72.93 32.92,0
  pour Bottom: 0,0 0,72.93 32.92,72.93 32.92,0
JACK_RX_N
  Top 0.22: 18.86,42.08 18.86,39.37 18.21,38.72 14.84,38.72 | 18.86,42.08 18.86,47.01 | 18.86,47.01 18.86,53.56 18.2,54.22 U14.6 | U13.4 18.86,42.08 | U13.5 18.86,47.01
  Top 0.228: U10.P$9 12.16,43.34 12.91,42.6 12.91,40.66 14.84,38.72
JACK_RX_P  (via drill 0.3)
  Top 0.22: U10.P$11 9.62,43.3 14.84,38.08 v17.43,38.08 | 18.49,42.08 18.49,40.66 18.07,40.24 v18.07,40.02 | 18.49,42.08 18.49,47.01 | 18.49,47.01 18.49,49.28 18.07,49.7 17.43,49.7 15.49,51.63 15.49,53.86 15.14,54.21 U14.3 | U13.3 18.49,42.08 | U13.6 18.49,47.01
  Bottom 0.22: v17.43,38.08 18.07,38.72 v18.07,40.02
JACK_TX_N
  Top 0.22: 14.84,39.37 15.67,39.37 16.32,40.02 16.32,42.08 | 16.32,42.08 16.32,47.01 | 16.32,47.01 16.32,50.16 14.84,51.63 14.84,52.92 | U14.2 14.12,53.65 14.2,53.57 | U13.7 16.32,47.01 | U13.2 16.32,42.08
  Top 0.228: U10.P$14 5.81,45.83 6.45,46.47 13.55,46.47 14.2,45.82 14.2,40.02 14.84,39.37 | 14.84,52.92 14.2,53.57
JACK_TX_P  (via drill 0.3)
  Top 0.22: U10.P$16 3.27,46.51 v3.87,47.11 | v15.3,40.02 15.95,40.66 15.95,42.08 | 15.95,42.08 15.95,47.01 | 15.95,47.01 15.95,49.24 13.1,52.09 U14.1 | U13.8 15.95,47.01 | U13.1 15.95,42.08
  Bottom 0.22: v3.87,47.11 12.26,47.11 12.91,46.47 12.91,43.24 13.55,42.6 13.55,41.31 14.84,40.02 v15.3,40.02
MCU_3V3  (via drill 0.3)
  Top 0.228: U6.P1 v29.04,38.08 | U1.P$101 12.05,14.41 12.26,14.2 v14.2,14.2 | v16.78,18.07 16.78,19.36 16.14,20.01 15.49,20.01 | 9.81,19.49 10.33,20.01 10.33,22.59 11.62,23.88
  Top 0.229: C16.1 28.07,22.07 C41.1 26.88,20.88 27.2,20.55 C42.1 25.82,19.36 25.29,19.89 U1.P$8 U1.P$7 22.46,19.49 21.94,20.01 | 20.01,28.4 17.43,28.4 | 17.43,28.4 16.14,28.4 15.25,29.28 U1.P$52 U1.P$51 | 17.43,28.4 17.25,28.57 U1.P$47 17.25,32.3 R22.1 17,34.31 R23.1 16.99,35.29 16.78,35.5 14.84,35.5 14.4,35.05 R24.1 11.12,34.7 10.89,34.93 U10.P$7 10.89,40.09 10.33,40.66 5.16,40.66 | 20.01,18.07 v16.78,18.07 16.85,18 U1.P$113 | 21.94,20.01 21.94,23.23 | 21.94,23.23 21.94,27.11 | 21.94,27.11 21.94,27.75 | 21.94,27.75 22.08,27.89 U1.P$28 27.89,27.89 29.1,29.1 C18.1 29.87,31.16 v30.33,31.62 | U1.P$26 21.96,27.09 21.94,27.11 | U1.P$16 22.09,23.09 21.94,23.23 | U1.P$90 9.81,19.49 | 11.62,23.88 11.62,27.75 11.48,27.89 U1.P$69 6.47,27.89 C40.1 | 11.62,23.88 11.61,23.89 U1.P$79 5.82,23.89 4.95,24.76 C43.1 | 15.49,20.01 11.62,23.88 | 20.01,18.07 20.45,17.63 U1.P$122 20.45,13.83 R41.2 20.3,13.2 19.61,12.51 U$1.3.3V | 20.01,18.07 21.3,18.07 21.94,18.72 21.94,20.01 | 20.01,28.4 20.45,28.84 U1.P$39 20.45,31.9 19.79,32.49 R21.1 | 20.01,28.4 21.3,28.4 21.94,27.75 | U10.P$2 4.54,40.04 5.16,40.66 | R44.1 1.92,42.61 2.58,41.95 4.52,41.95 5.16,41.31 5.16,40.66 | C22.1 30.24,51.73 30.82,51.15 C17.1 30.82,48.24 v30.33,47.76 29.58,47.01 D0.A
  Bottom 0.228: v30.33,31.62 30.33,33.56 29.69,34.21 | v29.04,38.08 29.69,38.08 | v14.2,14.2 14.84,14.2 16.14,15.49 16.14,17.43 v16.78,18.07
  Bottom 0.229: 29.69,34.21 29.69,38.08 29.69,47.11 v30.33,47.76
N$1  (via drill 0.3)
  Top 0.229: U$1.SENSE_O 23.78,9.78 v23.23,10.33 | U$1.SENSE_I 8.49,9.78 v9.04,10.33
  Bottom 0.229: v23.23,10.33 v9.04,10.33
N$3
  Top 0.229: R9.2 31.08,45.48 D0.C
N$6
  Top 0.229: R33.2 28.5,43.54 D1.C
N$16  (via drill 0.3)
  Top 0.229: U1.P$89 7.63,19.89 7.63,18.6 v6.45,17.43 | R49.2 2.58,27.11 1.94,26.46 v1.94,20.01
  Bottom 0.229: v1.94,20.01 2.58,20.01 4.52,18.07 5.81,18.07 v6.45,17.43
N$29
  Top 0.229: R49.1 3.13,28.77 C45.1 3.02,29.04 1.94,29.04 1.29,29.69 1.29,33.56 1.5,33.77 Y1.P$1
N$31  (via drill 0.3)
  Top 0.229: v2.43,30.18 C44.1 6.74,31.34 6.45,31.62 4.66,31.62 Y1.P$3 | U1.P$88 7.38,20.29 7.1,20.01 7.1,19.36 v6.45,18.72
  Bottom 0.229: v6.45,18.72 4.52,18.72 1.29,21.94 1.29,29.04 v2.43,30.18
N$32  (via drill 0.3)
  Top 0.229: R32.2 27.11,48.44 v27.11,49.05 | v5.16,49.05 4.54,48.43 U10.P$15
  Bottom 0.229: v27.11,49.05 v5.16,49.05
N$34  (via drill 0.3)
  Top 0.229: U10.P$10 10.89,43.32 v11.62,42.6 | v23.23,45.18 25.82,45.18 26.46,45.82
  Top 0.305: R43.2 26.46,45.82
  Bottom 0.22: 12.91,38.08 14.2,38.08 14.84,37.43 20.01,37.43 20.65,38.08 20.65,40.02
  Bottom 0.229: v11.62,42.6 11.62,39.37 12.91,38.08 | 20.65,40.02 20.65,44.53 21.3,45.18 v23.23,45.18
N$36
  Top 0.229: C1.1 21.85,42.3 R45.1 R46.1 23.55,46.03 R43.1 R32.1
N$44  (via drill 0.3)
  Top 0.229: R45.2 21.85,48.5 v20.01,50.34 | v16.78,51.63 16.16,52.26 U14.4 16.16,56.78 U14.5
  Bottom 0.229: v20.01,50.34 18.07,50.34 v16.78,51.63
N$45
  Top 0.229: R46.2 23.27,48.37 20.24,51.4 U14.8 20.24,56.78 U14.7
PN1  (via drill 0.3)
  Top 0.228: v29.04,36.79 30.33,38.08 30.33,39.37 29.04,40.66 27.75,40.66 26.46,41.95 26.46,43.99 D1.A
  Top 0.229: v15.49,17.43 14.85,16.79 U1.P$108 14.85,15.5 14.84,15.49
  Bottom 0.228: v15.49,17.43 15.49,18.72 29.04,32.27 v29.04,36.79
PQ0  (via drill 0.3)
  Top 0.229: U$1.CLK 9.88,10.53 v10.97,11.62 | v20.65,11.62 21.3,11.62 25.82,16.14 25.82,18.07 25.23,18.69 U1.P$5
  Bottom 0.229: v10.97,11.62 v20.65,11.62
PQ1  (via drill 0.3)
  Top 0.229: U$1.CS 12.66,10.72 v12.91,10.97 | U1.P$6 25.44,19.09 26.46,18.07 26.46,16.14 v21.3,10.97
  Bottom 0.229: v12.91,10.97 v21.3,10.97
PQ2  (via drill 0.3)
  Top 0.229: U$1.DO 15.44,11.57 v16.14,12.26 | U1.P$11 26.02,21.09 26.46,20.65 v26.46,20.01
  Bottom 0.229: v16.14,12.26 21.94,12.26 26.46,16.78 v26.46,20.01
PQ3  (via drill 0.3)
  Top 0.229: U$1.DI 18.22,12.41 v18.72,12.91 | U1.P$27 26.08,27.49 26.46,27.11 v26.46,26.46
  Bottom 0.229: v18.72,12.91 21.94,12.91 25.82,16.78 25.82,24.52 26.46,25.17 v26.46,26.46
RBIAS
  Top 0.229: U1.P$59 12.45,31.85 11.87,32.43 R25.1
TARGET_TCK/SWCLK  (via drill 0.3)
  Top 0.228: U6.P4 26.48,32.29 v24.52,30.33 | U1.P$100 11.65,16.81 v12.26,17.43
  Bottom 0.228: v24.52,30.33 20.01,25.82 16.14,25.82 12.26,21.94 v12.26,17.43
TARGET_TDI  (via drill 0.3)
  Top 0.228: U6.P8 23.94,32.98 v23.23,32.27 | U1.P$98 10.85,18.6 v10.97,18.72
  Bottom 0.228: v23.23,32.27 23.23,31.62 21.3,29.69 21.3,28.4 20.01,27.11 16.14,27.11 10.33,21.3 10.33,19.36 v10.97,18.72
TARGET_TDO/SWO  (via drill 0.3)
  Top 0.228: U6.P6 25.21,32.31 v24.52,31.62 | v10.97,20.01 10.33,19.36 10.33,16.78 10.45,16.66 U1.P$97
  Bottom 0.228: v24.52,31.62 21.94,29.04 21.94,28.4 20.01,26.46 16.14,26.46 10.97,21.3 v10.97,20.01
TARGET_TMS/SWDIO  (via drill 0.3)
  Top 0.228: U6.P2 27.75,32.27 v26.46,30.98 | v12.91,19.36 11.25,17.7 U1.P$99
  Bottom 0.228: v26.46,30.98 20.65,25.17 16.14,25.17 12.91,21.94 v12.91,19.36
TARGET_VDDC  (via drill 0.3)
  Top 0.229: U1.P$87 7.71,20.69 v7.1,21.3 6.58,21.81 C15.1 4.83,21.81 C14.1 3.14,21.39 2.58,21.94 2.58,25.82 4.09,27.32 C4.1 | U1.P$115 17.65,13.78 17.43,13.55 v16.78,13.55
  Bottom 0.228: 12.91,13.55 9.68,13.55 7.1,16.14 v7.1,21.3
  Bottom 0.229: v16.78,13.55 12.91,13.55
VREF+  (via drill 0.3)
  Top 0.229: R41.1 21.42,13.68 v21.94,14.2 | U1.P$9 22.87,20.29 v22.59,20.65
  Bottom 0.229: v21.94,14.2 22.59,15.49 v22.59,20.65

### Text on the board
bPlace: Slippi | 02/28/2016 | Revision 2
Document: Layer Stackup / Top silkscreen / Top Solder Mask / Component Side / Layer 2 / Layer 3 / Solder Side / Bottom Solder Mask / Bottom Silkscreen | File Names / EK-TM4C129EXL.sst / EK-TM4C129EXL.smt / EK-TM4C129EXL.l1 / EK-TM4C129EXL.l2 / EK-TM4C129EXL.l3 / EK-TM4C129EXL.l4 / EK-TM4C129EXL.smb / EK-TM4C129EXL.ssb | NOTES: UNLESS OTHERWISE SPECIFIED / 1) Manufacture in accordance with IPC-6012, Type 3, Class 2. / 2) End Product Features shall not vary more than 20% from artwork originals / 3) Material shall be ROHS compliant, copper clad FR-406, NEMA Grade (Tg 170degC) / Per IPC-4101, Color Natural, or equivalent / 4) Construction shall be symetrical multilayer per layer stackup detail / 5) Copper weight on inner layers shall be 1 oz per square foot / 6) Equivalent copper weight on outler layers shall be 1.0 oz per square foot before plating / 7) All plated through holes shall have a minimum of 0.0007 inches of copper / 8) Drill hole tolerance after plating shall be +/- 0.003 inches / 9) Minimum annular ring shall be 0.001 inches / 10) Minmum annular rint at emergent conductors shall be 0.003 inches / 11) PCB Thickness shall be 0.062 inches +/- 0.007 inches / 12) Warp / Twist shall not exceed 0.010 inches per inch / 13) Finish shall be LPI, Gloss RED SMOBC, Both sides balance of exposed copper shall be HASL / 14) Silkscreen with nonconductive white epoxy ink / 15) Board stack-up should be targetted such that a differential impedance of 90 ohms +/- 10% can / be achieved on the top layer with 10.8 mil traces and 6 mil spacing. Additionally 100 ohm +/- 10% / with 8.7 mil traces and 6 mil spacing. Boards do not need to be impedance controlled.